# EAGLE design RingBottom (EAGLE 9.6.2)
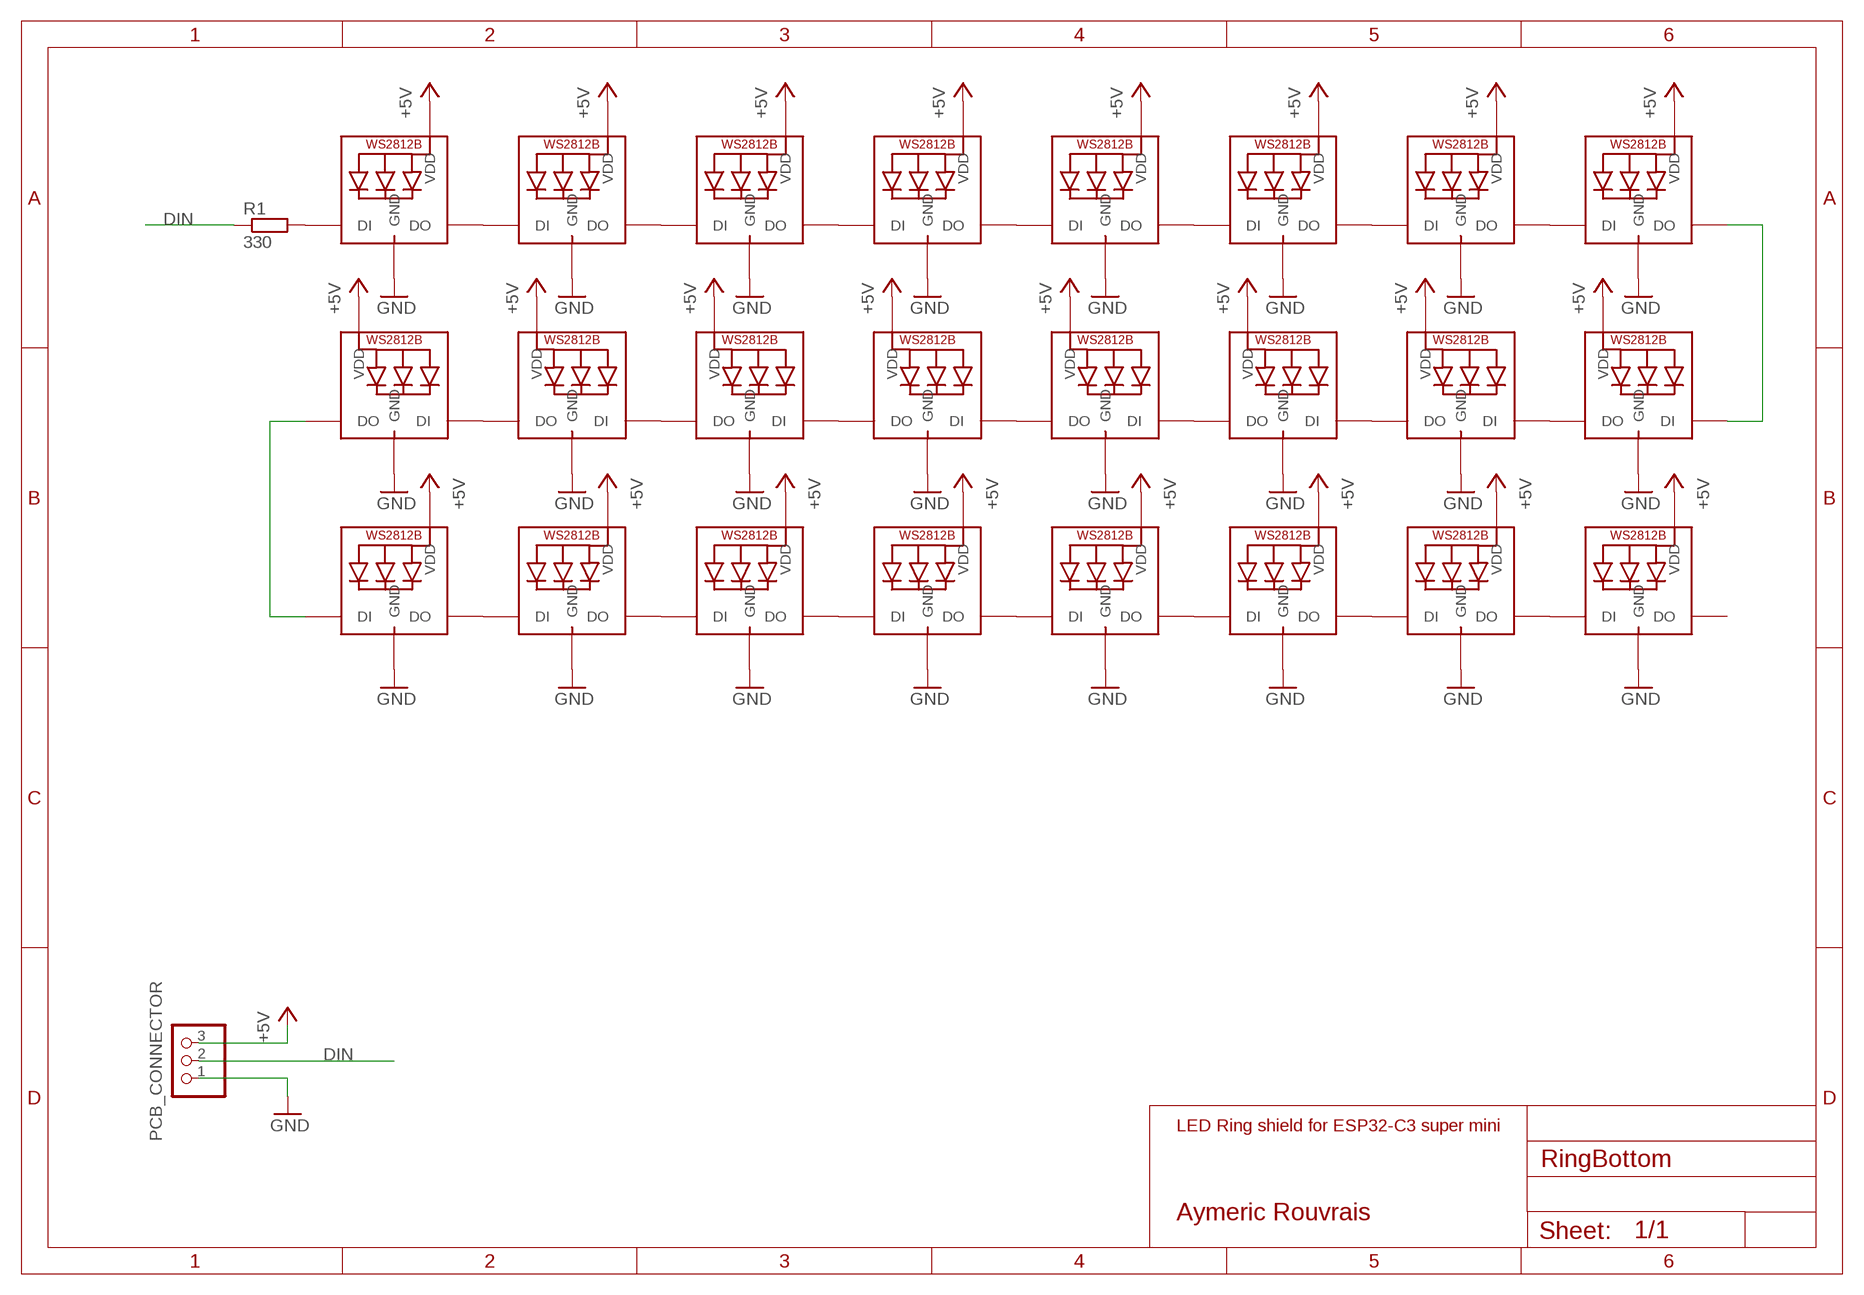
[diagram p0: schematic, sheet 1]

## Parts
LED1  WS2812B5050  [WS2812B]
LED2  WS2812B5050  [WS2812B]
LED3  WS2812B5050  [WS2812B]
LED4  WS2812B5050  [WS2812B]
LED5  WS2812B5050  [WS2812B]
LED6  WS2812B5050  [WS2812B]
LED7  WS2812B5050  [WS2812B]
LED8  WS2812B5050  [WS2812B]
LED9  WS2812B5050  [WS2812B]
LED10  WS2812B5050  [WS2812B]
LED11  WS2812B5050  [WS2812B]
LED12  WS2812B5050  [WS2812B]
LED13  WS2812B5050  [WS2812B]
LED14  WS2812B5050  [WS2812B]
LED15  WS2812B5050  [WS2812B]
LED16  WS2812B5050  [WS2812B]
LED17  WS2812B5050  [WS2812B]
LED18  WS2812B5050  [WS2812B]
LED19  WS2812B5050  [WS2812B]
LED20  WS2812B5050  [WS2812B]
LED21  WS2812B5050  [WS2812B]
LED22  WS2812B5050  [WS2812B]
LED23  WS2812B5050  [WS2812B]
LED24  WS2812B5050  [WS2812B]
PCB_CONNECTOR  PINHD-1X3  [1X03]
R1  330  R-EU_0204/7  [0204/7]

## Nets
+5V: LED1.1-VDD(VDD) LED2.1-VDD(VDD) LED3.1-VDD(VDD) LED4.1-VDD(VDD) LED5.1-VDD(VDD) LED6.1-VDD(VDD) LED7.1-VDD(VDD) LED8.1-VDD(VDD) LED9.1-VDD(VDD) LED10.1-VDD(VDD) LED11.1-VDD(VDD) LED12.1-VDD(VDD) LED13.1-VDD(VDD) LED14.1-VDD(VDD) LED15.1-VDD(VDD) LED16.1-VDD(VDD) LED17.1-VDD(VDD) LED18.1-VDD(VDD) LED19.1-VDD(VDD) LED20.1-VDD(VDD) LED21.1-VDD(VDD) LED22.1-VDD(VDD) LED23.1-VDD(VDD) LED24.1-VDD(VDD) PCB_CONNECTOR.3
DIN: PCB_CONNECTOR.2 R1.1
GND: LED1.3-GND(GND) LED2.3-GND(GND) LED3.3-GND(GND) LED4.3-GND(GND) LED5.3-GND(GND) LED6.3-GND(GND) LED7.3-GND(GND) LED8.3-GND(GND) LED9.3-GND(GND) LED10.3-GND(GND) LED11.3-GND(GND) LED12.3-GND(GND) LED13.3-GND(GND) LED14.3-GND(GND) LED15.3-GND(GND) LED16.3-GND(GND) LED17.3-GND(GND) LED18.3-GND(GND) LED19.3-GND(GND) LED20.3-GND(GND) LED21.3-GND(GND) LED22.3-GND(GND) LED23.3-GND(GND) LED24.3-GND(GND) PCB_CONNECTOR.1
N$1: LED1.2-DOUT(DO) LED2.4-DIN(DI)
N$2: LED2.2-DOUT(DO) LED3.4-DIN(DI)
N$3: LED3.2-DOUT(DO) LED4.4-DIN(DI)
N$4: LED1.4-DIN(DI) R1.2
N$5: LED6.2-DOUT(DO) LED7.4-DIN(DI)
N$6: LED7.2-DOUT(DO) LED8.4-DIN(DI)
N$7: LED16.2-DOUT(DO) LED17.4-DIN(DI)
N$8: LED15.2-DOUT(DO) LED16.4-DIN(DI)
N$9: LED12.2-DOUT(DO) LED13.4-DIN(DI)
N$10: LED4.2-DOUT(DO) LED5.4-DIN(DI)
N$11: LED11.2-DOUT(DO) LED12.4-DIN(DI)
N$12: LED8.2-DOUT(DO) LED9.4-DIN(DI)
N$13: LED17.2-DOUT(DO) LED18.4-DIN(DI)
N$14: LED18.2-DOUT(DO) LED19.4-DIN(DI)
N$15: LED19.2-DOUT(DO) LED20.4-DIN(DI)
N$16: LED5.2-DOUT(DO) LED6.4-DIN(DI)
N$17: LED22.2-DOUT(DO) LED23.4-DIN(DI)
N$18: LED23.2-DOUT(DO) LED24.4-DIN(DI)
N$19: LED21.2-DOUT(DO) LED22.4-DIN(DI)
N$20: LED10.2-DOUT(DO) LED11.4-DIN(DI)
N$21: LED14.2-DOUT(DO) LED15.4-DIN(DI)
N$22: LED13.2-DOUT(DO) LED14.4-DIN(DI)
N$23: LED9.2-DOUT(DO) LED10.4-DIN(DI)
N$24: LED20.2-DOUT(DO) LED21.4-DIN(DI)
Unconnected: LED24.2-DOUT(DO)

## Notes on the sheet
- LED Ring shield for ESP32-C3 super mini
- Aymeric Rouvrais

## Library data of the parts
LED1-LED24 = WS2812B:WS2812B: Check availability <https://pricing.snapeda.com/parts/WS2812B/Worldsemi/view-part?ref=eda>; AVAILABILITY: In Stock; CHECK_PRICES: https://www.snapeda.com/parts/WS2812B/Worldsemi/view-part/?ref=eda; DESCRIPTION: Intelligent control LED integrated light source; MF: Worldsemi; MP: WS2812B; PACKAGE: None; PRICE: None; SNAPEDA_LINK: https://www.snapeda.com/parts/WS2812B/Worldsemi/view-part/?ref=snap
PCB_CONNECTOR = pinhead:PINHD-1X3: PIN HEADER
R1 = rcl:R-EU_: RESISTOR, European symbol; SPICEPREFIX: R

## Board
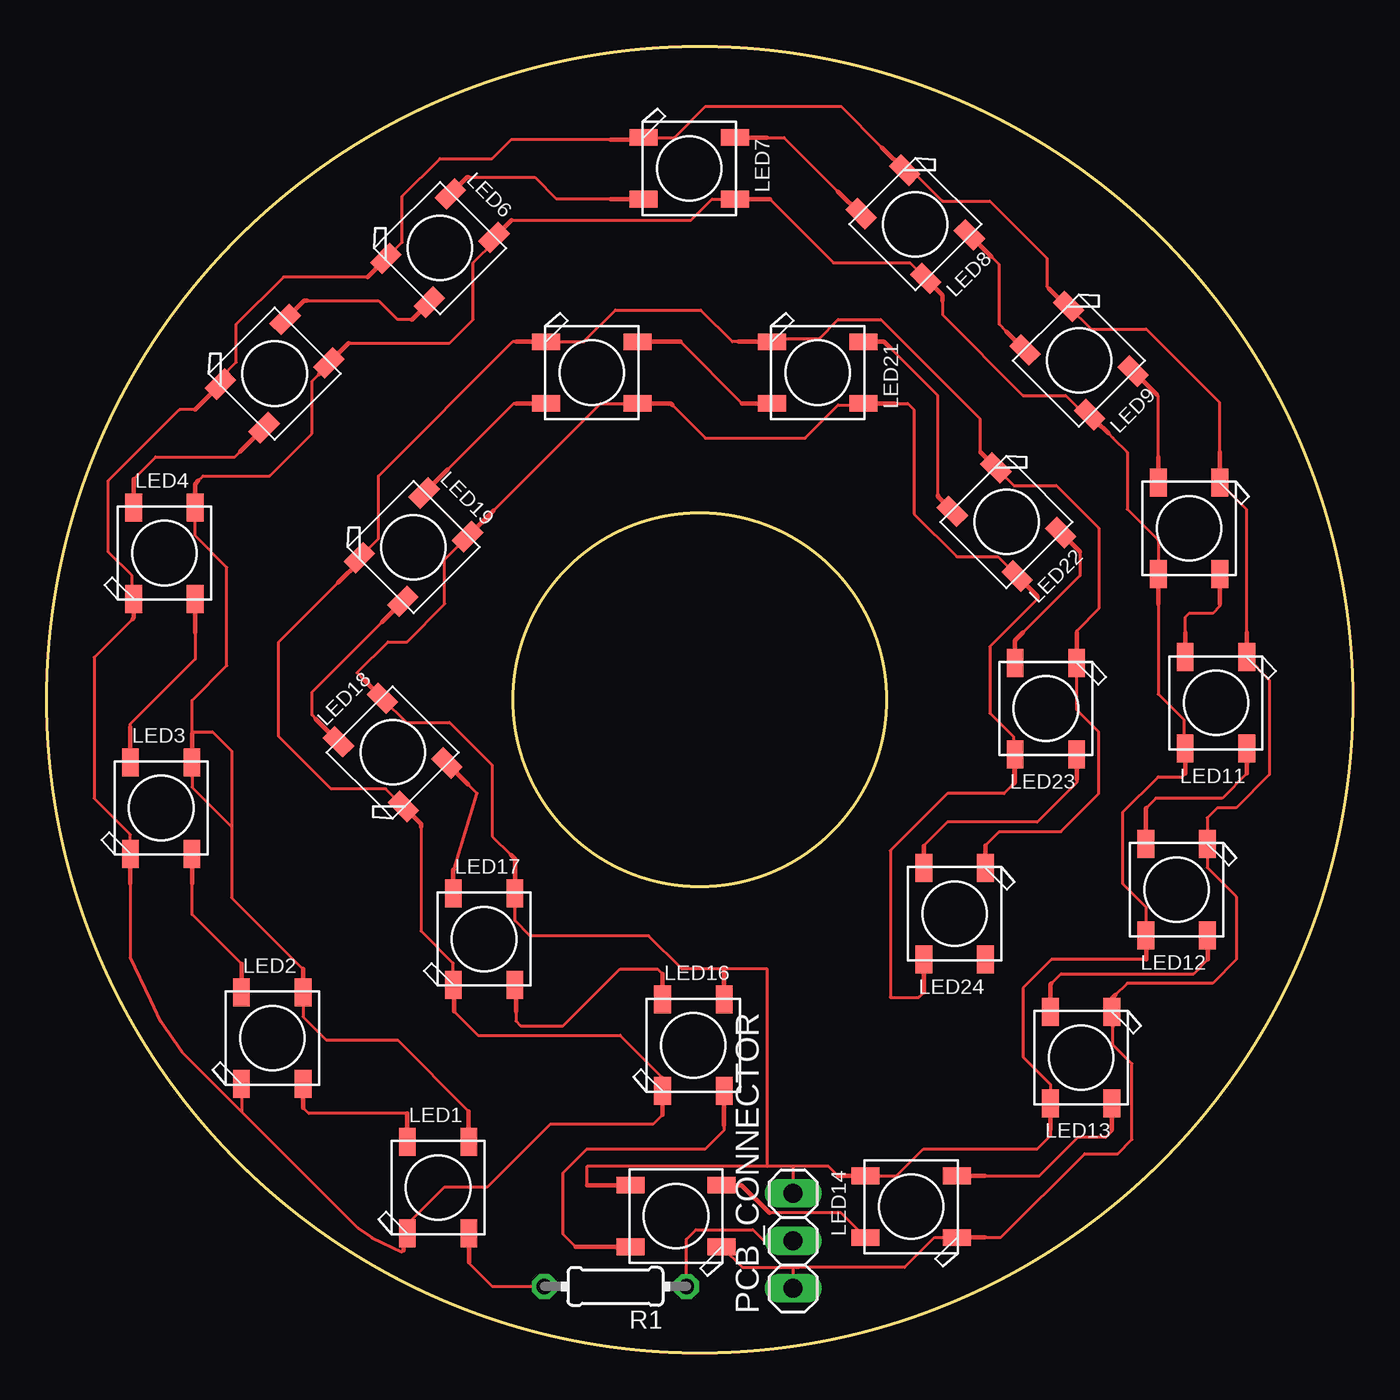
[diagram p1: board, top side]

Size 70 x 70 mm. Coordinates in mm from the lower left corner, seen from the top.
Outline: circle at 35,35 radius 10
Outline: circle at 35,35 radius 35
Copper layers (1*16): Top 0.035mm / dielectric 1.5mm / Bottom 0.035mm
Design rules "default": minimum track width 6mil, minimum drill 0.35mm, track to track 6mil, track to pad 6mil, pad to pad 6mil, via to via 6mil, smd to smd 6mil, copper to edge 40mil, drill to drill 6mil, minimum pad ring 10mil, minimum via ring 8mil, stop-mask expansion 4mil, vias tented up to drill 0mil, thermal gap 10mil

### Footprints (pad centres in the part's own frame; a part is rotated, then mirrored left to right if it is on the bottom)
WS2812B = smd 1.5 x 0.9: 1-VDD 2.45,-1.65; 2-DOUT 2.45,1.65; 3-GND -2.45,1.65; 4-DIN -2.45,-1.65
1X03 = drill 1.016 long: 1 -2.54,0; 2 0,0; 3 2.54,0
0204/7 = drill 0.813 octagon: 1 -3.81,0; 2 3.81,0

### Placement (x,y rotation side)
LED1  20.98,8.86 90 top
LED2  12.09,16.86 90 top
LED3  6.14,29.2 90 top
LED4  6.31,42.86 90 top
LED5  12.22,52.48 45 top
LED6  21.08,59.21 45 top
LED7  34.44,63.48 0 top
LED8  46.55,60.48 315 top
LED9  55.33,53.18 315 top
LED10  61.22,44.18 270 top
LED11  62.66,34.83 270 top
LED12  60.55,24.83 270 top
LED13  55.44,15.83 270 top
LED14  46.33,7.83 180 top
LED15  33.73,7.34 180 top
LED16  34.66,16.48 90 top
LED17  23.44,22.18 90 top
LED18  18.55,32.18 135 top
LED19  19.66,43.18 45 top
LED20  29.22,52.53 0 top
LED21  41.33,52.53 0 top
LED22  51.44,44.53 315 top
LED23  53.55,34.53 270 top
LED24  48.66,23.53 270 top
PCB_CONNECTOR  40,6 90 top
R1  30.48,3.56 180 top

### Tracks (layer width: path | path; a pad name or v marks a point on that pad's centre or on a via)
+5V
  Top 0.152: 22.61,12.95 18.8,16.76 14.99,16.76 13.74,18.01 LED2.1-VDD | 13.74,20.58 13.71,20.58 9.91,24.38 9.91,28.19 | 9.91,28.19 9.91,32.26 8.89,33.27 7.87,33.27 7.79,33.19 7.79,34.97 9.65,36.83 9.65,42.09 7.96,43.79 LED4.1-VDD | 8.13,46.74 8.38,46.99 11.94,46.99 14.22,49.28 14.22,52.07 14.61,52.45 14.73,52.58 | 38.75,61.83 42.16,58.42 46.28,58.42 LED8.1-VDD | 56.9,49.28 57.15,49.03 57.15,49.02 57.91,48.26 57.91,45.21 59.57,43.55 LED10.1-VDD | 42.42,9.48 41.91,9.99 39.88,9.99 | 39.88,9.99 38.61,9.99 | 38.61,9.99 28.96,9.99 28.96,8.99 | 38.61,9.99 38.61,20.57 36.32,20.57 36.31,20.57 34.04,20.57 32.26,22.35 25.91,22.35 25.09,23.17 LED17.1-VDD | LED14.1-VDD 45.55,9.48 46.99,10.92 53.09,10.92 53.79,11.63 53.79,11.94 | 58.93,21.08 53.85,21.08 52.32,19.56 52.32,15.86 53.79,14.4 LED13.1-VDD | 59.57,40.13 59.57,35.31 60.96,33.92 60.96,32.43 LED11.1-VDD | 61.01,31.04 60.84,30.87 59.57,30.87 57.66,28.96 57.66,25.15 58.9,23.9 LED12.1-VDD | 17.02,36.07 16.64,36.45 18.29,38.1 19.3,38.1 21.34,40.13 21.34,42.52 LED19.1-VDD | 23.95,45.14 29.69,50.88 LED20.1-VDD | 33.53,50.8 35.31,49.02 40.64,49.02 42.42,50.8 43.7,50.8 LED21.1-VDD 43.86,50.8 | LED22.1-VDD 50.97,42.67 48.77,42.67 46.48,44.96 46.48,50.55 46.15,50.88 45.47,50.88 | LED23.1-VDD 51.82,32 | 51.82,32 51.82,30.48 51.31,29.97 48.26,29.97 45.21,26.92 45.21,19.05 46.74,19.05 47.01,19.32 | 51.82,32 51.82,33.02 50.55,34.29 50.55,37.85 53.09,40.39 | 16.18,54.1 21.59,54.1 22.86,55.37 22.86,58.42 23.98,59.53 | LED18.1-VDD 19.28,33.78 21.59,33.78 23.88,31.5 23.88,27.69 24.89,26.67 | LED3.1-VDD 7.79,30.31 9.91,28.19 | LED7.1-VDD 35.67,61.83 34.54,60.71 24.91,60.71
  Top 0.152: 48.01,56.39 48.01,55.63 52.32,51.31 54.61,51.31 56.01,49.91 56.26,49.91 | PCB_CONNECTOR.3 40,9.98 39.88,9.99
  Top 0.229: LED16.1-VDD 36.31,20.56 36.32,20.57 | LED14.1-VDD 42.42,9.48 | LED13.1-VDD 53.79,11.94 | LED12.1-VDD 58.93,22.35 58.93,21.08 | LED11.1-VDD 61.01,31.04 | LED10.1-VDD 59.57,40.13 | LED9.1-VDD 56.26,49.91 56.9,49.28 | LED8.1-VDD 48.01,56.69 48.01,56.39 | LED7.1-VDD 38.75,61.83 | 24.91,60.71 LED6.1-VDD 23.98,59.53 | 16.18,54.1 LED5.1-VDD 15.12,52.97 14.61,52.45 | LED4.1-VDD 7.96,46.57 8.13,46.74 | LED3.1-VDD 7.79,33.19 | LED18.1-VDD 17.02,36.05 17.02,36.07 | LED2.1-VDD 13.74,20.58 | LED1.1-VDD 22.61,11.33 22.61,12.95 | LED15.1-VDD 28.96,8.99 | LED24.1-VDD 47.01,19.32 | LED23.1-VDD 51.9,30.56 51.82,30.48 | LED22.1-VDD 53.09,40.55 53.09,40.39 | LED21.1-VDD 45.47,50.88 | LED20.1-VDD 33.45,50.88 33.53,50.8 | LED19.1-VDD 23.95,45.14 | LED17.1-VDD 25.09,26.47 24.89,26.67
  Top 0.24: LED16.1-VDD 36.31,20.57
DIN
  Top 0.152: R1.1 34.29,6.1 34.8,6.6 37.85,6.6 38.35,6.1 PCB_CONNECTOR.2
GND
  Top 0.152: 17.43,6.16 16.69,6.67 10.44,12.93 | 17.43,6.16 | 17.43,6.16 19.03,5.41 19.13,5.51 | LED2.3-GND 10.44,12.93 | 10.44,12.93 7.27,16.1 6.11,17.76 5.57,18.91 4.49,21.23 4.49,25.15 | 4.6,39.34 2.54,37.27 2.54,29.72 4.49,27.77 LED3.3-GND | LED4.3-GND 4.57,40.5 4.57,41.66 3.3,42.93 3.3,46.74 7.11,50.55 7.95,50.55 | LED5.3-GND 9.32,52.25 10.16,53.09 10.16,55.12 12.7,57.66 17.19,57.66 | LED6.3-GND 19.05,59.52 19.05,61.98 21.08,64.01 23.88,64.01 24.89,65.02 30.23,65.02 | LED7.3-GND 33.63,65.13 35.31,66.8 42.56,66.8 44.78,64.59 | LED8.3-GND 46.35,63.38 48.01,61.72 50.55,61.72 53.59,58.67 53.59,57.15 53.72,57.02 | LED9.3-GND 55.98,54.86 58.93,54.86 62.87,50.92 62.87,48.26 | LED10.3-GND 64.31,45.19 64.31,38.61 | LED11.3-GND 65.53,36.06 65.53,30.99 63.75,29.21 62.74,29.21 62.2,28.67 LED12.3-GND 62.2,26.01 63.75,24.46 63.75,21.08 62.48,19.81 57.91,19.81 57.28,19.18 | 50.29,6.18 51.14,6.18 55.63,10.67 57.4,10.67 58.17,11.43 58.17,15.49 57.15,16.51 57.15,17.53 57.15,17.78 | LED1.3-GND 19.33,6.88 21.34,8.89 23.62,8.89 26.98,12.25 32.5,12.25 33.01,12.76 | LED15.3-GND 37.29,4.57 40,4.57 | LED14.3-GND 47.58,6.18 45.97,4.57 40.3,4.57 40.13,4.57 40,4.57 | 21.84,18.29 23.11,17.02 30.73,17.02 33.01,14.74 LED16.3-GND | LED17.3-GND 21.79,20.88 20.07,22.61 20.07,28.19 | LED18.3-GND 18.17,30.23 15.24,30.23 12.45,33.02 12.45,38.1 15.62,41.27 | LED19.3-GND 17.78,43.63 17.78,46.99 24.97,54.18 25.15,54.18 | LED20.3-GND 28.78,54.18 30.48,55.88 35.05,55.88 36.75,54.18 37.08,54.18 | LED21.3-GND 39.06,54.36 41.4,54.36 42.42,55.37 44.7,55.37 50.04,50.04 50.04,48.27 | LED22.3-GND 51.82,46.48 54.1,46.48 56.39,44.2 56.39,39.88 55.2,38.69 55.2,38.61
  Top 0.152: LED23.3-GND 55.2,34.46 56.39,33.27 56.39,29.97 54.36,27.94 51.05,27.94 50.31,27.2 | 40,4.57 PCB_CONNECTOR.1
  Top 0.229: LED24.3-GND 50.31,27.2 | LED16.3-GND 33.01,12.76 | LED14.3-GND 50.29,6.18 | 57.28,19.18 57.09,18.99 LED13.3-GND 57.15,18.22 57.15,17.53 | LED11.3-GND 64.31,38.61 | LED10.3-GND 62.87,48.26 | LED9.3-GND 54.66,56.08 53.72,57.02 | LED8.3-GND 44.78,64.59 | LED7.3-GND 31.88,65.02 30.23,65.02 | LED6.3-GND 17.19,57.66 | LED5.3-GND 7.95,50.55 | LED4.3-GND 4.66,39.39 4.6,39.34 | LED3.3-GND 4.49,25.15 | LED1.3-GND 19.13,6.21 19.13,5.51 | LED23.3-GND 55.2,38.61 | LED22.3-GND 50.04,48.27 | LED21.3-GND 37.08,54.18 | LED20.3-GND 25.15,54.18 | LED19.3-GND 16.76,42.41 15.62,41.27 | LED18.3-GND 20.07,28.33 20.07,28.19 | LED17.3-GND 21.84,19.68 21.84,18.29
N$1
  Top 0.152: 19.3,12.83 14.05,12.83 13.74,13.14
  Top 0.229: LED2.4-DIN 13.74,13.14 | LED1.2-DOUT 19.33,12.81 19.3,12.83
N$2
  Top 0.152: 10.44,20.83 7.79,23.48 7.79,25.15
  Top 0.229: LED3.4-DIN 7.79,25.15 | LED2.2-DOUT 10.44,20.83
N$3
  Top 0.152: 4.49,33.53 4.49,33.7 7.96,37.17 7.96,38.61
  Top 0.229: LED4.4-DIN 7.96,38.61 | LED3.2-DOUT 4.49,33.53
N$4
  Top 0.152: 22.63,4.85 22.61,4.83 23.88,3.56 R1.2
  Top 0.229: LED1.4-DIN 22.63,4.85
N$5
  Top 0.152: 22.61,62.99 26.16,62.99 27.32,61.83 30.23,61.83
  Top 0.229: LED7.4-DIN 30.23,61.83 | LED6.2-DOUT 22.52,62.99 22.61,62.99
N$6
  Top 0.152: 38.61,65.13 39.52,65.13 42.42,62.23
  Top 0.229: LED8.4-DIN 43.6,61.05 42.42,62.23 | LED7.2-DOUT 38.61,65.13
N$7
  Top 0.152: 33.01,20.31 33,20.32 32.75,20.57 30.73,20.57 27.69,17.53 25.4,17.53 25.15,17.78 25.15,18.29
  Top 0.229: LED16.2-DOUT 33.01,20.31 | LED17.4-DIN 25.15,19.67 25.15,18.29
  Top 0.24: LED16.2-DOUT 33,20.32
N$8
  Top 0.152: 36.31,12.19 36.31,11.93 35.31,10.92 28.96,10.92 27.69,9.65 27.69,6.35 28.35,5.69
  Top 0.229: LED16.4-DIN 36.31,12.19 | LED15.2-DOUT 28.35,5.69
N$9
  Top 0.152: 53.85,19.81 54.36,20.32 61.47,20.32 62.23,21.08
  Top 0.229: LED13.4-DIN 53.79,19.75 53.85,19.81 | LED12.2-DOUT 62.23,22.35 62.23,21.08
N$10
  Top 0.152: 10.37,48.3 10.08,48.01 5.84,48.01 4.66,46.82
  Top 0.229: LED5.4-DIN 10.37,48.3 | LED4.2-DOUT 4.66,46.82
N$11
  Top 0.152: 64.31,31.04 62.99,29.72 59.44,29.72 58.93,29.21
  Top 0.229: LED11.2-DOUT 64.31,31.04 | LED12.4-DIN 58.9,29.18 58.93,29.21
N$12
  Top 0.152: 51.44,54.74 51.05,55.12 51.05,58.31 50.62,58.75
  Top 0.229: LED9.4-DIN 51.44,54.74 | LED8.2-DOUT 50.62,58.75
N$13
  Top 0.152: 21.82,25.91 23.08,29.99 22.59,30.47
  Top 0.229: LED17.2-DOUT 21.79,25.88 21.82,25.91 | LED18.4-DIN 22.59,30.47
N$14
  Top 0.152: 14.42,33.98 14.22,34.17 14.22,35.41 17.98,39.17
  Top 0.229: LED18.2-DOUT 14.42,33.98 | 17.98,39.17 LED19.4-DIN
N$15
  Top 0.152: 21.49,47.34 25.03,50.88 25.15,50.88
  Top 0.229: LED20.4-DIN 25.15,50.88 | LED19.2-DOUT 21.49,47.34
N$16
  Top 0.152: 13.97,56.39 17.78,56.39 18.8,55.37 19.56,55.37
  Top 0.229: LED6.4-DIN 19.57,55.37 19.56,55.37 | LED5.2-DOUT 13.79,56.39 13.97,56.39
N$17
  Top 0.152: 55.37,42.93 55.37,41.66 52.32,38.61
  Top 0.229: LED23.4-DIN 51.9,38.18 52.32,38.61 | LED22.2-DOUT 55.37,42.93
N$18
  Top 0.152: 55.2,30.73 55.2,30.56 53.09,28.45 48.26,28.45 47.01,27.2 47.01,27.18
  Top 0.229: LED24.4-DIN 47.01,27.18 | LED23.2-DOUT 55.2,30.73
N$19
  Top 0.152: 45.21,53.85 47.75,51.31 47.75,45.97
  Top 0.229: LED22.4-DIN 47.75,45.88 47.75,45.97 | LED21.2-DOUT 44.88,54.18 45.21,53.85
N$20
  Top 0.152: 62.87,40.13 62.87,40.01 62.48,39.62 61.21,39.62 61.01,39.42 61.01,38.61
  Top 0.229: LED11.4-DIN 61.01,38.61 | LED10.2-DOUT 62.87,40.13
N$21
  Top 0.152: LED14.2-DOUT 42.57,7.49 38.73,7.49
  Top 0.229: LED15.4-DIN 37.24,8.99 38.73,7.49
N$22
  Top 0.152: 50.29,9.48 53.19,9.48 55.26,11.55 56.76,11.55 57.09,11.88 57.09,11.94
  Top 0.229: LED14.4-DIN 50.29,9.48 | LED13.2-DOUT 57.09,12.45 57.09,12.36 57.09,11.94
N$23
  Top 0.152: 59.49,51.36 59.57,51.27 59.57,48.01
  Top 0.229: LED10.4-DIN 59.57,48.01 | LED9.2-DOUT 59.49,51.36
N$24
  Top 0.152: 33.96,54.18 37.26,50.88
  Top 0.229: LED21.4-DIN 37.26,50.88 | LED20.2-DOUT 33.96,54.18